# EAGLE board WestLaunch (EAGLE 7.7.0), part 1 of 2
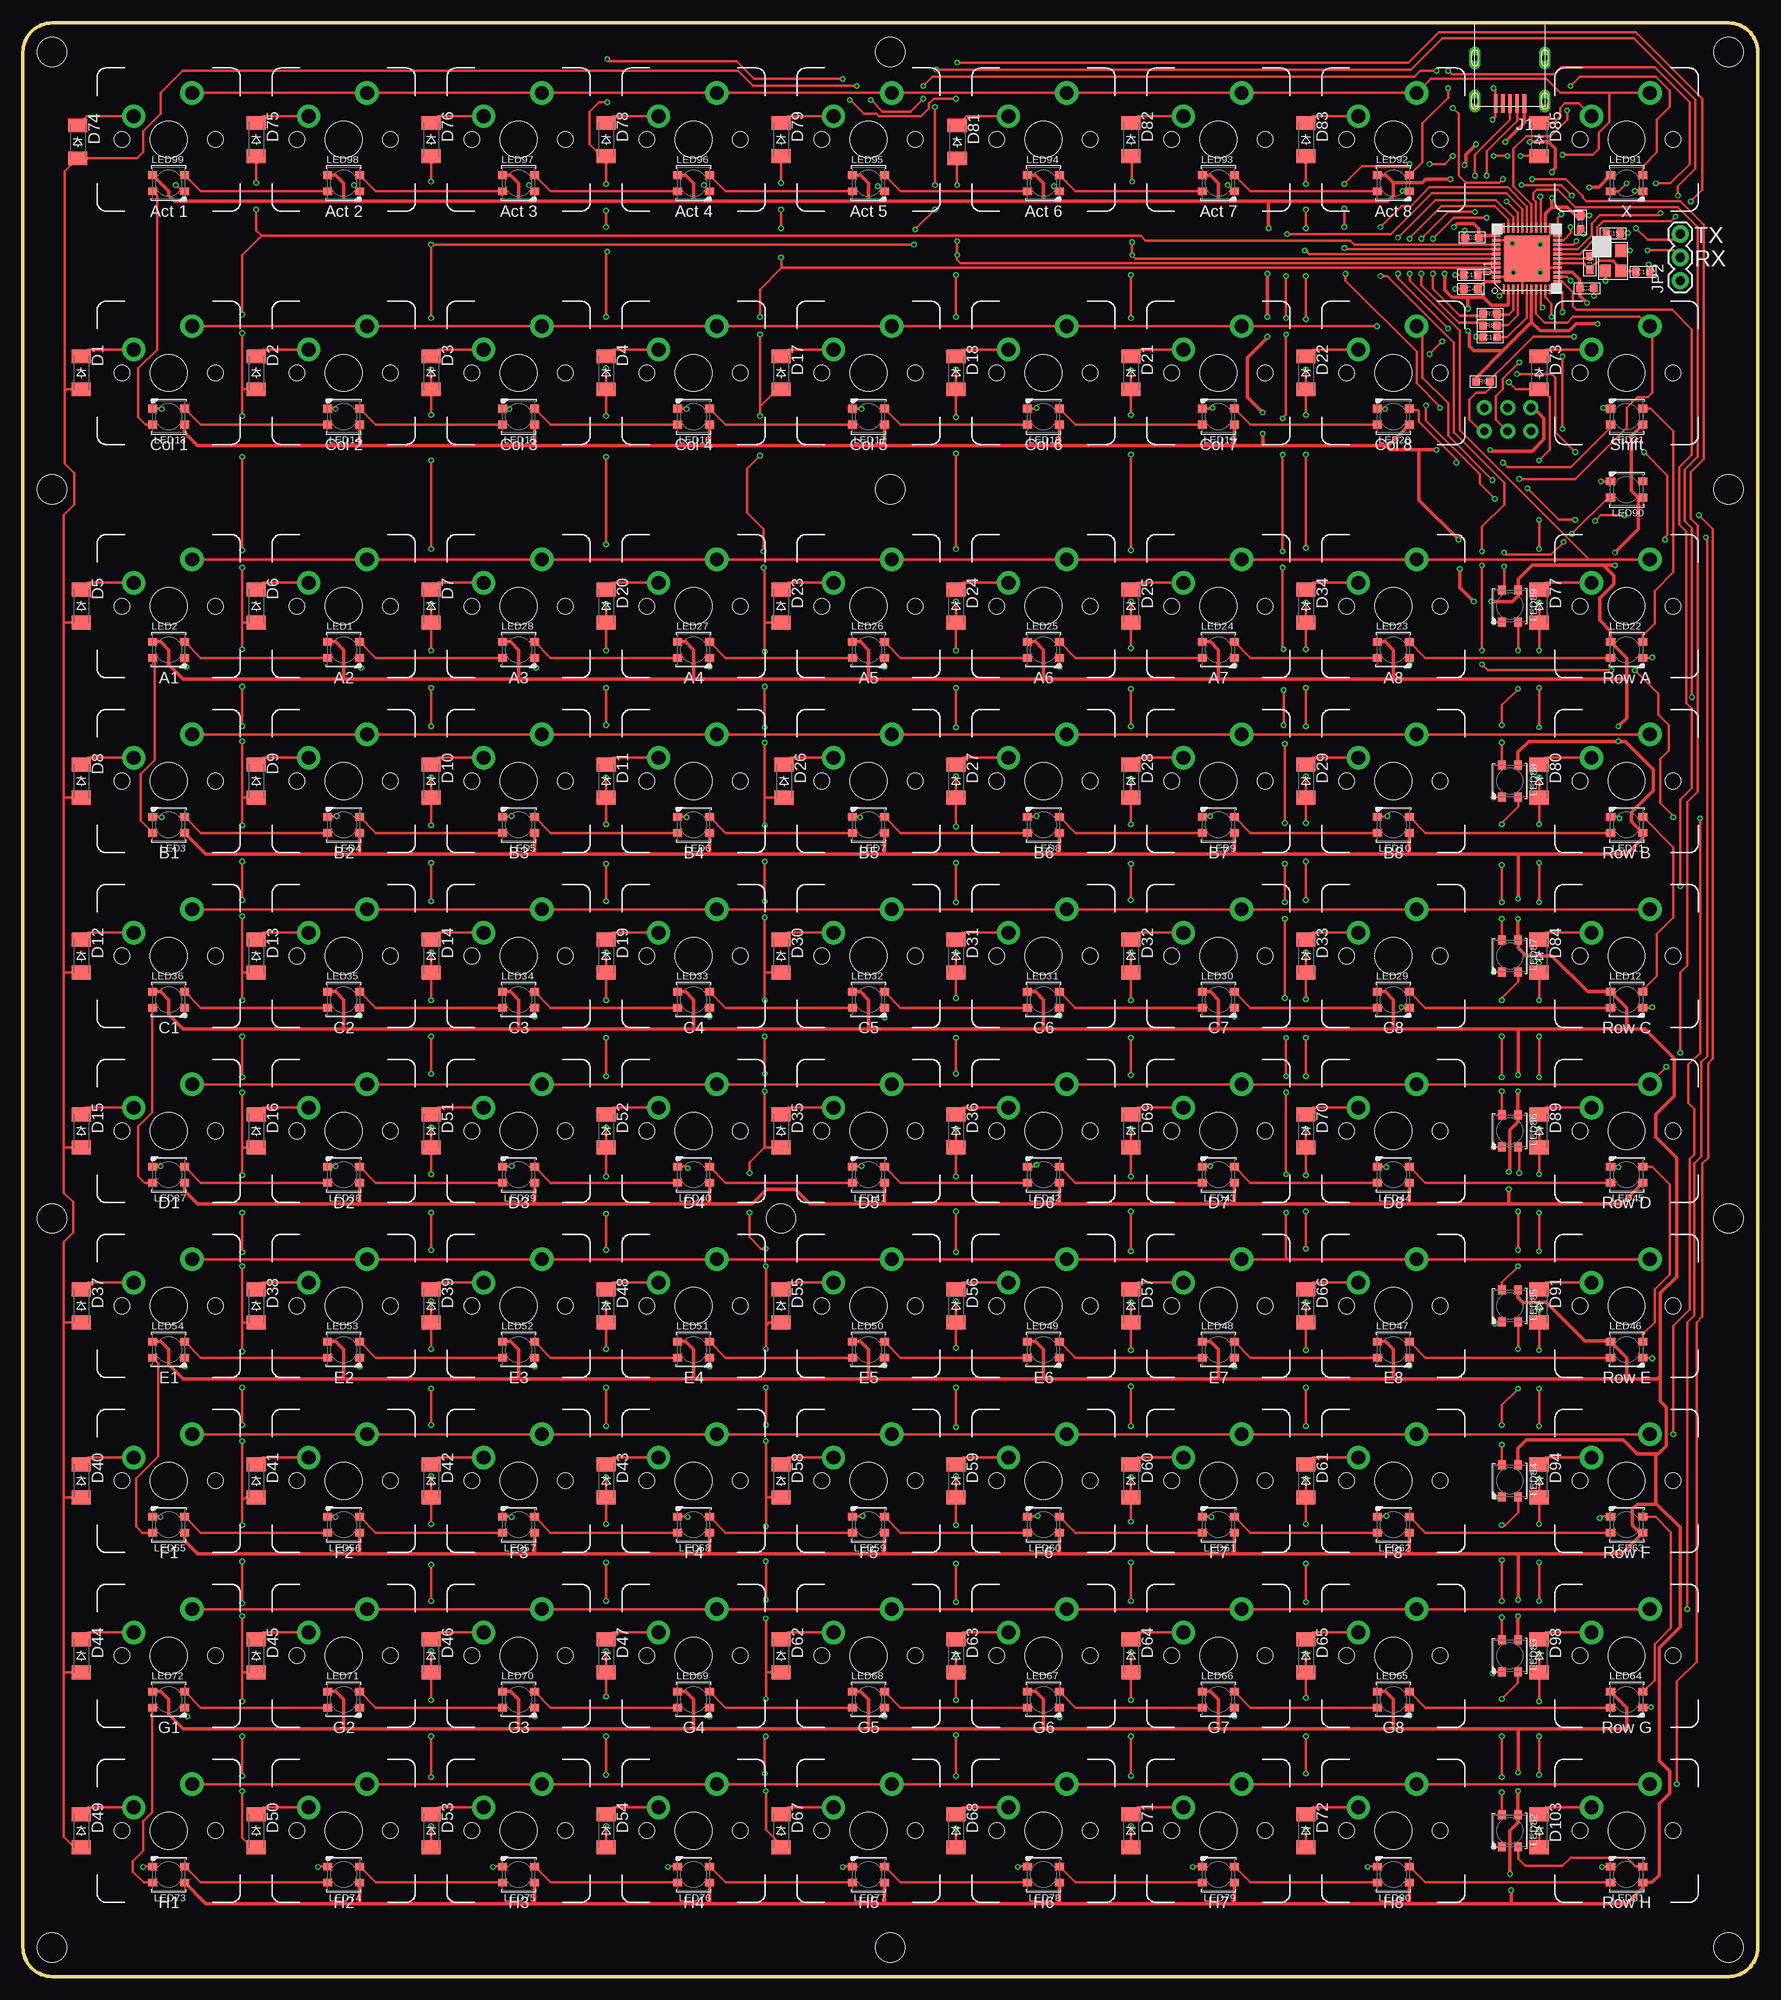
[diagram p2: board, top side]
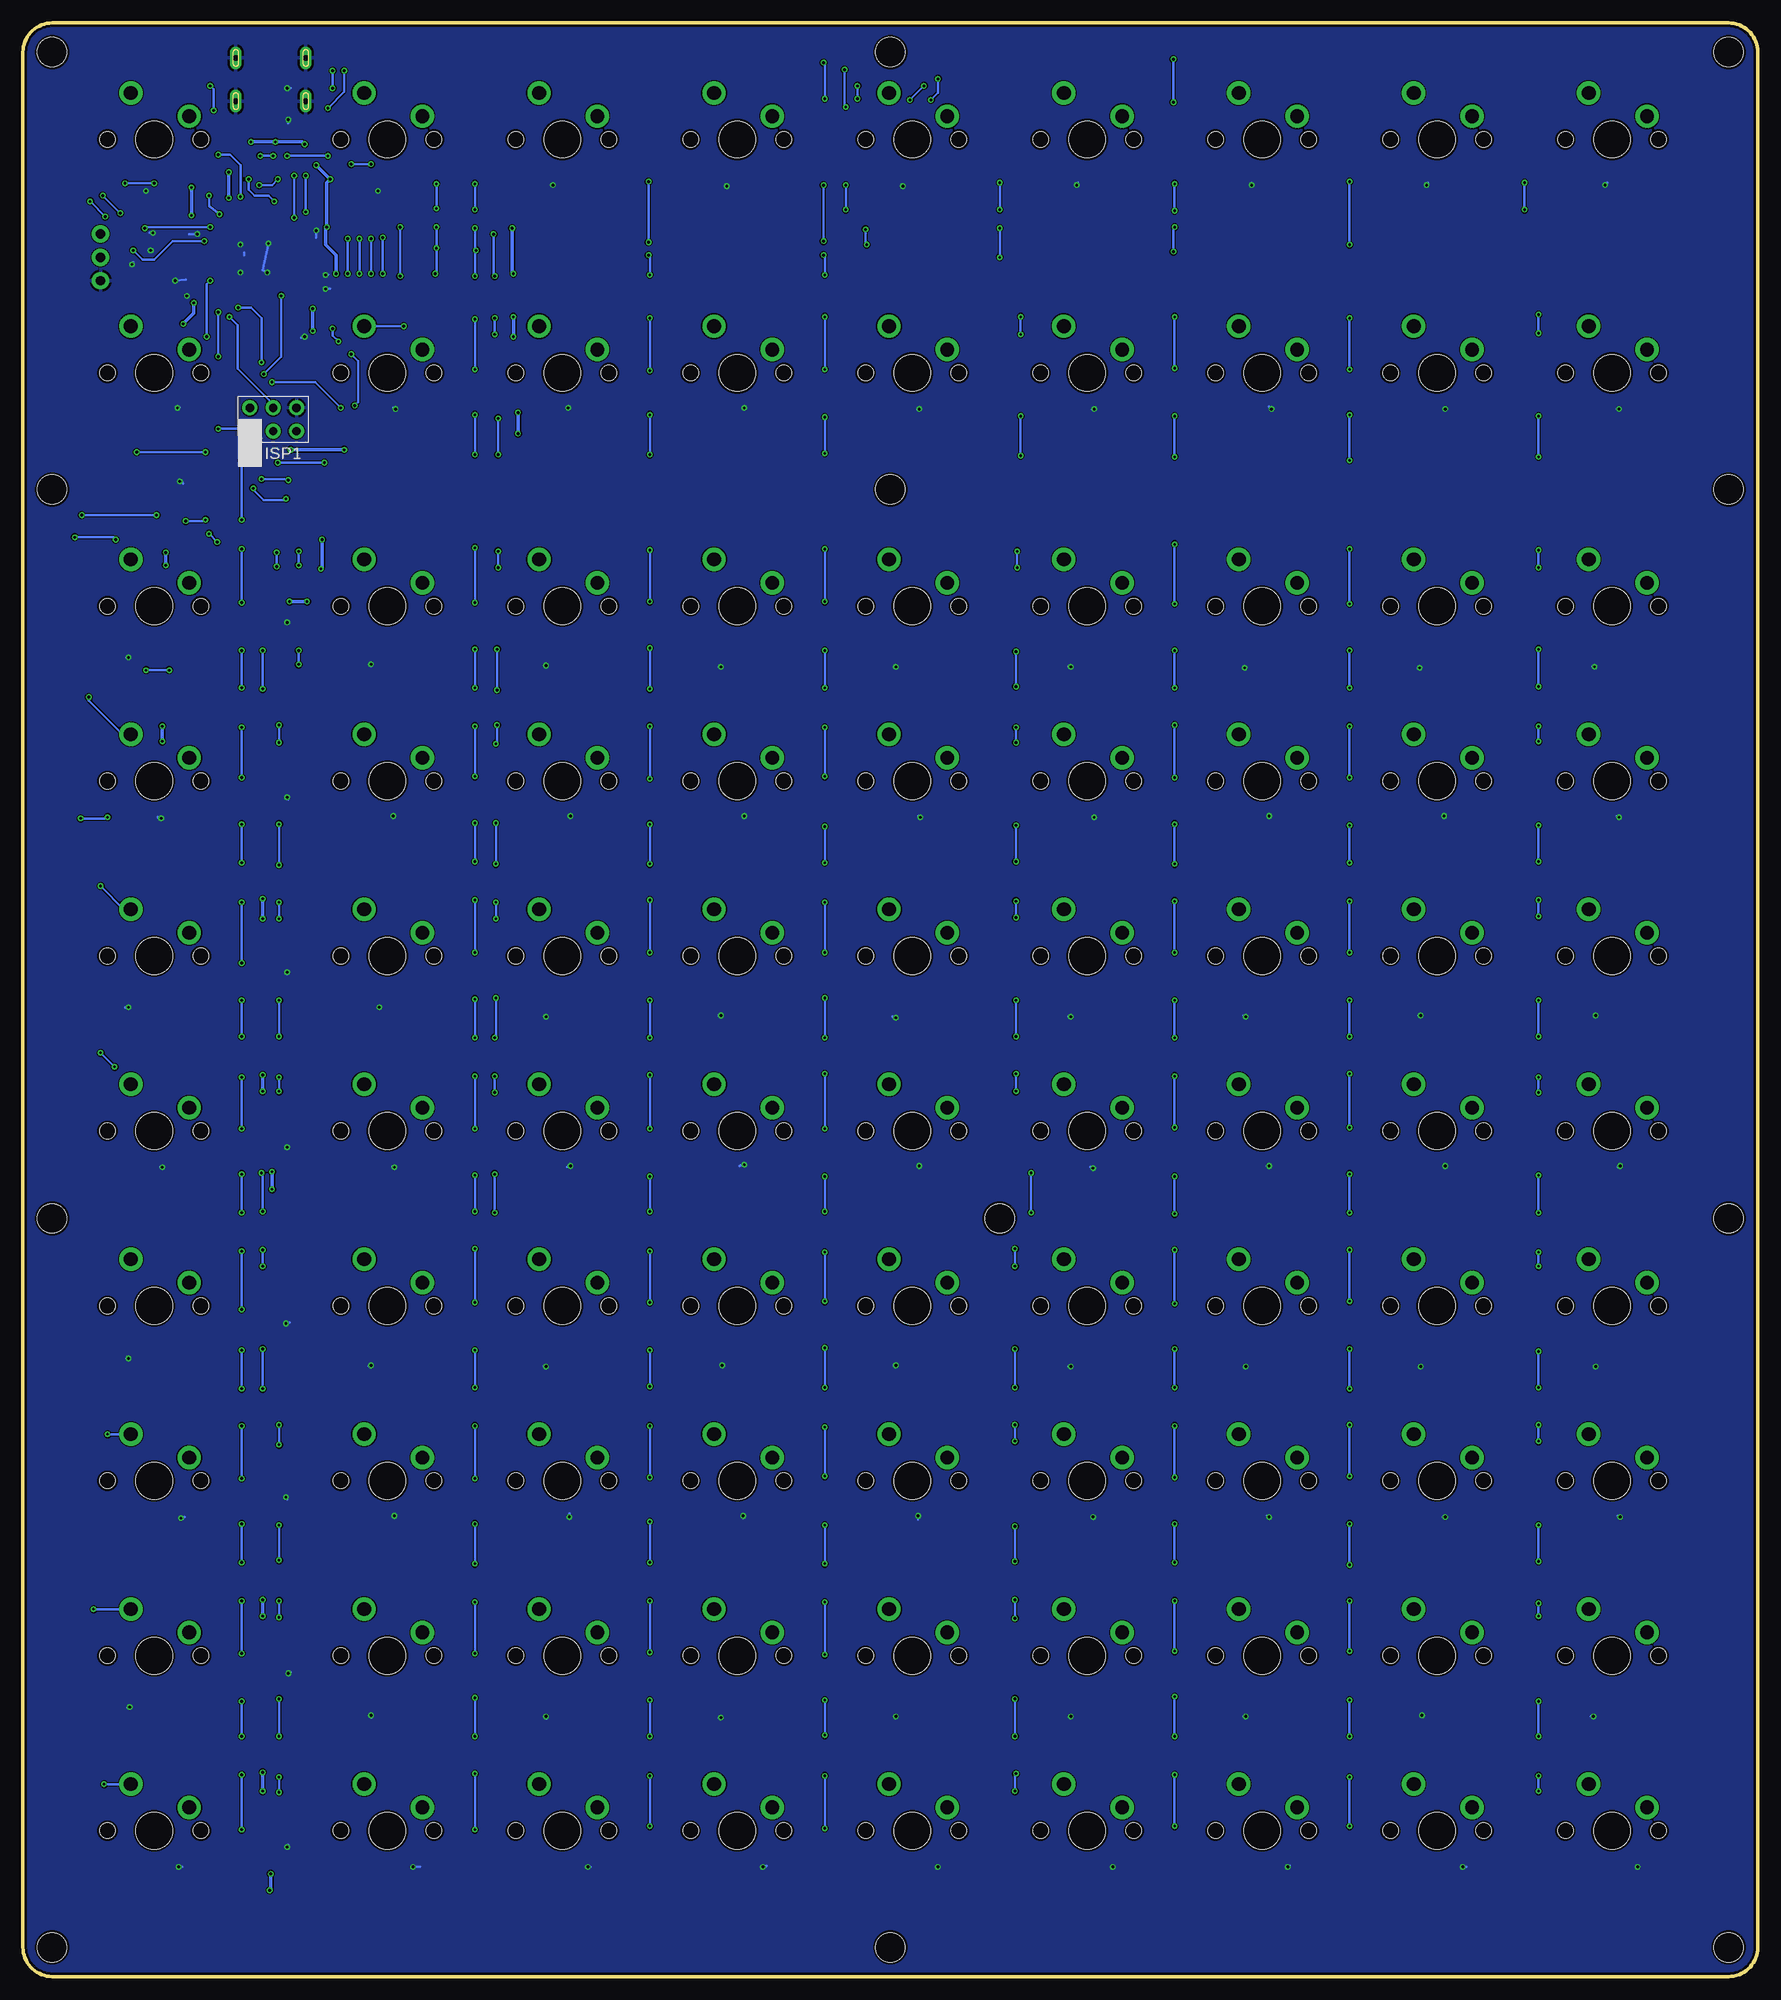
[diagram p3: board, bottom side, seen from below]

Size 188.91 x 212.72 mm. Coordinates in mm from the lower left corner, seen from the top.
Outline: 3.17,212.72 185.74,212.72 arc-90 188.91,209.55 188.91,3.18 arc-90 185.74,0 3.17,0 arc-90 0,3.18 0,209.55 arc-90 3.17,212.72
Copper layers (1*16): Top 0.035mm / dielectric 1.5mm / Bottom 0.035mm
Design rules "dirt_cheap_dirty_boards.v1": minimum track width 5mil, minimum drill 12mil, track to track 5mil, track to pad 5mil, pad to pad 5mil, via to via 5mil, smd to smd 0mil, copper to edge 10mil, drill to drill 10mil, minimum pad ring 10mil, minimum via ring 6mil, stop-mask expansion 2mil, vias tented up to drill 25mil, thermal gap 10mil
Net classes: 0 default: width 0.254 mm; 1 power: width 0.381 mm
Holes 3.2 mm at 3.17,209.55 3.17,3.18 3.17,161.93 94.46,161.93 185.74,209.55 185.74,3.18 185.74,82.55 82.55,82.55 94.46,3.18 94.46,209.55 3.17,82.55 185.74,161.93

## Footprints (pad centres in the part's own frame; a part is rotated, then mirrored left to right if it is on the bottom)
C0603 = smd 0.889 x 0.889: 1 -0.762,0; 2 0.762,0
SOD-123_MINI-SMA = smd 1.5 x 2.1: A 1.8,0; C -1.8,0
AVRISP = drill 0.9 pad 1.626: 1 -1.27,2.54; 2 1.27,2.54; 3 -1.27,0; 4 1.27,0; 5 -1.27,-2.54; 6 1.27,-2.54
MINI-B-5P-SMD = smd 0.406 x 2.032: 1 -1.575,4.191; 2 -0.787,4.191; 3 0,4.191; 4 0.787,4.191; 5 1.575,4.191 | drill 0.635 pad 1.27 long: GND@1 3.81,3.937; GND@2 3.81,-0.762; GND@3 -3.81,-0.762; GND@4 -3.81,3.937
1X03 = drill 1.016 pad 1.88: 1 0,0; 2 2.54,0; 3 5.08,0
LED3535 = smd 1 x 0.85: 1 -1.75,0.875; 2 -1.75,-0.875; 3 1.75,-0.875; 4 1.75,0.875
R0603 = smd 0.889 x 0.889: 1 -0.762,0; 2 0.762,0
MX1A-XXNW = drill 1.5 pad 2.54: 1 -3.81,2.54; 2 2.54,5.08 | hole 4: 0,0 | hole 1.7: -5.08,0; 5.08,0
QFN44 = smd 1 x 0.3: 1 -3.35,2.5; 2 -3.35,2; 3 -3.35,1.5; 4 -3.35,1; 5 -3.35,0.5; 6 -3.35,0; 7 -3.35,-0.5; 8 -3.35,-1; 9 -3.35,-1.5; 10 -3.35,-2; 11 -3.35,-2.5; 23 3.35,-2.5; 24 3.35,-2; 25 3.35,-1.5; 26 3.35,-1; 27 3.35,-0.5; 28 3.35,0; 29 3.35,0.5; 30 3.35,1; 31 3.35,1.5; 32 3.35,2; 33 3.35,2.5 | smd 0.3 x 1: 12 -2.5,-3.35; 13 -2,-3.35; 14 -1.5,-3.35; 15 -1,-3.35; 16 -0.5,-3.35; 17 0,-3.35; 18 0.5,-3.35; 19 1,-3.35; 20 1.5,-3.35; 21 2,-3.35; 22 2.5,-3.35; 34 2.5,3.35; 35 2,3.35; 36 1.5,3.35; 37 1,3.35; 38 0.5,3.35; 39 0,3.35; 40 -0.5,3.35; 41 -1,3.35; 42 -1.5,3.35; 43 -2,3.35; 44 -2.5,3.35 | smd 5.08 x 5.08: TAB 0,0
16MHZXTAL = smd 1.4 x 1.2: P$1 -1.1,-0.85; P$2 1.1,-0.85; P$3 1.1,0.85; P$4 -1.1,0.85

## Placement (x,y rotation side)
C1  100n  [C0603]  169.61,191.01 90 top
C2  100n  [C0603]  170.31,183.83 180 top
C3  100n  [C0603]  157.8,189.36 0 top
C4  100n  [C0603]  157.67,183.77 0 top
C13  100n  [C0603]  157.67,185.29 180 top
C14  1u  [C0603]  159.77,178.5 180 top
C15  22p  [C0603]  173.16,189.8 0 top
C16  22p  [C0603]  176.4,185.61 0 top
D1  CGRM4001-G  [SOD-123_MINI-SMA]  6.35,174.62 270 top
D2  CGRM4001-G  [SOD-123_MINI-SMA]  25.4,174.62 270 top
D3  CGRM4001-G  [SOD-123_MINI-SMA]  44.45,174.62 270 top
D4  CGRM4001-G  [SOD-123_MINI-SMA]  63.5,174.62 270 top
D5  CGRM4001-G  [SOD-123_MINI-SMA]  6.35,149.22 270 top
D6  CGRM4001-G  [SOD-123_MINI-SMA]  25.4,149.22 270 top
D7  CGRM4001-G  [SOD-123_MINI-SMA]  44.45,149.22 270 top
D8  CGRM4001-G  [SOD-123_MINI-SMA]  6.35,130.18 270 top
D9  CGRM4001-G  [SOD-123_MINI-SMA]  25.4,130.18 270 top
D10  CGRM4001-G  [SOD-123_MINI-SMA]  44.45,130.18 270 top
D11  CGRM4001-G  [SOD-123_MINI-SMA]  63.5,130.18 270 top
D12  CGRM4001-G  [SOD-123_MINI-SMA]  6.35,111.12 270 top
D13  CGRM4001-G  [SOD-123_MINI-SMA]  25.4,111.12 270 top
D14  CGRM4001-G  [SOD-123_MINI-SMA]  44.45,111.12 270 top
D15  CGRM4001-G  [SOD-123_MINI-SMA]  6.35,92.08 270 top
D16  CGRM4001-G  [SOD-123_MINI-SMA]  25.4,92.08 270 top
D17  CGRM4001-G  [SOD-123_MINI-SMA]  82.55,174.62 270 top
D18  CGRM4001-G  [SOD-123_MINI-SMA]  101.6,174.62 270 top
D19  CGRM4001-G  [SOD-123_MINI-SMA]  63.5,111.12 270 top
D20  CGRM4001-G  [SOD-123_MINI-SMA]  63.5,149.22 270 top
D21  CGRM4001-G  [SOD-123_MINI-SMA]  120.65,174.62 270 top
D22  CGRM4001-G  [SOD-123_MINI-SMA]  139.7,174.62 270 top
D23  CGRM4001-G  [SOD-123_MINI-SMA]  82.55,149.22 270 top
D24  CGRM4001-G  [SOD-123_MINI-SMA]  101.6,149.22 270 top
D25  CGRM4001-G  [SOD-123_MINI-SMA]  120.65,149.22 270 top
D26  CGRM4001-G  [SOD-123_MINI-SMA]  82.87,130.18 270 top
D27  CGRM4001-G  [SOD-123_MINI-SMA]  101.6,130.18 270 top
D28  CGRM4001-G  [SOD-123_MINI-SMA]  120.65,130.18 270 top
D29  CGRM4001-G  [SOD-123_MINI-SMA]  139.7,130.18 270 top
D30  CGRM4001-G  [SOD-123_MINI-SMA]  82.55,111.12 270 top
D31  CGRM4001-G  [SOD-123_MINI-SMA]  101.6,111.12 270 top
D32  CGRM4001-G  [SOD-123_MINI-SMA]  120.65,111.12 270 top
D33  CGRM4001-G  [SOD-123_MINI-SMA]  139.7,111.12 270 top
D34  CGRM4001-G  [SOD-123_MINI-SMA]  139.7,149.22 270 top
D35  CGRM4001-G  [SOD-123_MINI-SMA]  82.55,92.08 270 top
D36  CGRM4001-G  [SOD-123_MINI-SMA]  101.6,92.08 270 top
D37  CGRM4001-G  [SOD-123_MINI-SMA]  6.35,73.03 270 top
D38  CGRM4001-G  [SOD-123_MINI-SMA]  25.4,73.03 270 top
D39  CGRM4001-G  [SOD-123_MINI-SMA]  44.45,73.03 270 top
D40  CGRM4001-G  [SOD-123_MINI-SMA]  6.35,53.97 270 top
D41  CGRM4001-G  [SOD-123_MINI-SMA]  25.4,53.97 270 top
D42  CGRM4001-G  [SOD-123_MINI-SMA]  44.45,53.97 270 top
D43  CGRM4001-G  [SOD-123_MINI-SMA]  63.5,53.97 270 top
D44  CGRM4001-G  [SOD-123_MINI-SMA]  6.35,34.92 270 top
D45  CGRM4001-G  [SOD-123_MINI-SMA]  25.4,34.92 270 top
D46  CGRM4001-G  [SOD-123_MINI-SMA]  44.45,34.92 270 top
D47  CGRM4001-G  [SOD-123_MINI-SMA]  63.5,34.92 270 top
D48  CGRM4001-G  [SOD-123_MINI-SMA]  63.5,73.03 270 top
D49  CGRM4001-G  [SOD-123_MINI-SMA]  6.35,15.88 270 top
D50  CGRM4001-G  [SOD-123_MINI-SMA]  25.4,15.88 270 top
D51  CGRM4001-G  [SOD-123_MINI-SMA]  44.45,92.08 270 top
D52  CGRM4001-G  [SOD-123_MINI-SMA]  63.5,92.08 270 top
D53  CGRM4001-G  [SOD-123_MINI-SMA]  44.45,15.88 270 top
D54  CGRM4001-G  [SOD-123_MINI-SMA]  63.5,15.88 270 top
D55  CGRM4001-G  [SOD-123_MINI-SMA]  82.55,73.03 270 top
D56  CGRM4001-G  [SOD-123_MINI-SMA]  101.6,73.03 270 top
D57  CGRM4001-G  [SOD-123_MINI-SMA]  120.65,73.03 270 top
D58  CGRM4001-G  [SOD-123_MINI-SMA]  82.55,53.97 270 top
D59  CGRM4001-G  [SOD-123_MINI-SMA]  101.6,53.97 270 top
D60  CGRM4001-G  [SOD-123_MINI-SMA]  120.65,53.97 270 top
D61  CGRM4001-G  [SOD-123_MINI-SMA]  139.7,53.97 270 top
D62  CGRM4001-G  [SOD-123_MINI-SMA]  82.55,34.92 270 top
D63  CGRM4001-G  [SOD-123_MINI-SMA]  101.6,34.92 270 top
D64  CGRM4001-G  [SOD-123_MINI-SMA]  120.65,34.92 270 top
D65  CGRM4001-G  [SOD-123_MINI-SMA]  139.7,34.92 270 top
D66  CGRM4001-G  [SOD-123_MINI-SMA]  139.7,73.03 270 top
D67  CGRM4001-G  [SOD-123_MINI-SMA]  82.55,15.88 270 top
D68  CGRM4001-G  [SOD-123_MINI-SMA]  101.6,15.88 270 top
D69  CGRM4001-G  [SOD-123_MINI-SMA]  120.65,92.08 270 top
D70  CGRM4001-G  [SOD-123_MINI-SMA]  139.7,92.08 270 top
D71  CGRM4001-G  [SOD-123_MINI-SMA]  120.65,15.88 270 top
D72  CGRM4001-G  [SOD-123_MINI-SMA]  139.7,15.88 270 top
D73  CGRM4001-G  [SOD-123_MINI-SMA]  165.1,174.62 270 top
D74  CGRM4001-G  [SOD-123_MINI-SMA]  5.97,199.77 270 top
D75  CGRM4001-G  [SOD-123_MINI-SMA]  25.4,200.03 270 top
D76  CGRM4001-G  [SOD-123_MINI-SMA]  44.45,200.03 270 top
D77  CGRM4001-G  [SOD-123_MINI-SMA]  165.1,149.22 270 top
D78  CGRM4001-G  [SOD-123_MINI-SMA]  63.5,200.03 270 top
D79  CGRM4001-G  [SOD-123_MINI-SMA]  82.55,200.03 270 top
D80  CGRM4001-G  [SOD-123_MINI-SMA]  165.1,130.18 270 top
D81  CGRM4001-G  [SOD-123_MINI-SMA]  101.73,199.77 270 top
D82  CGRM4001-G  [SOD-123_MINI-SMA]  120.65,200.03 270 top
D83  CGRM4001-G  [SOD-123_MINI-SMA]  139.7,200.03 270 top
D84  CGRM4001-G  [SOD-123_MINI-SMA]  165.1,111.12 270 top
D85  CGRM4001-G  [SOD-123_MINI-SMA]  165.1,200.03 270 top
D89  CGRM4001-G  [SOD-123_MINI-SMA]  165.1,92.08 270 top
D91  CGRM4001-G  [SOD-123_MINI-SMA]  165.1,73.03 270 top
D94  CGRM4001-G  [SOD-123_MINI-SMA]  165.1,53.97 270 top
D98  CGRM4001-G  [SOD-123_MINI-SMA]  165.1,34.92 270 top
D103  CGRM4001-G  [SOD-123_MINI-SMA]  165.1,15.88 270 top
ISP1  AVRISP-6  [AVRISP]  161.67,169.54 90 bottom
J1  MINI-USB-5P-3400030P1  [MINI-B-5P-SMD]  161.92,208.15 180 top
JP2  [1X03]  180.47,184.66 90 top
LED1  WS2812B3535  [LED3535]  34.93,144.46 0 top
LED2  WS2812B3535  [LED3535]  15.87,144.46 0 top
LED3  WS2812B3535  [LED3535]  15.87,125.41 180 top
LED4  WS2812B3535  [LED3535]  34.93,125.41 180 top
LED5  WS2812B3535  [LED3535]  53.98,125.41 180 top
LED6  WS2812B3535  [LED3535]  73.02,125.41 180 top
LED7  WS2812B3535  [LED3535]  92.07,125.41 180 top
LED8  WS2812B3535  [LED3535]  111.12,125.41 180 top
LED9  WS2812B3535  [LED3535]  130.17,125.41 180 top
LED10  WS2812B3535  [LED3535]  149.22,125.41 180 top
LED11  WS2812B3535  [LED3535]  174.62,125.41 180 top
LED12  WS2812B3535  [LED3535]  174.62,106.36 0 top
LED13  WS2812B3535  [LED3535]  15.87,169.86 180 top
LED14  WS2812B3535  [LED3535]  34.93,169.86 180 top
LED15  WS2812B3535  [LED3535]  53.98,169.86 180 top
LED16  WS2812B3535  [LED3535]  73.02,169.86 180 top
LED17  WS2812B3535  [LED3535]  92.07,169.86 180 top
LED18  WS2812B3535  [LED3535]  111.12,169.86 180 top
LED19  WS2812B3535  [LED3535]  130.17,169.86 180 top
LED20  WS2812B3535  [LED3535]  149.22,169.86 180 top
LED21  WS2812B3535  [LED3535]  174.62,169.86 180 top
LED22  WS2812B3535  [LED3535]  174.62,144.46 0 top
LED23  WS2812B3535  [LED3535]  149.22,144.46 0 top
LED24  WS2812B3535  [LED3535]  130.17,144.46 0 top
LED25  WS2812B3535  [LED3535]  111.12,144.46 0 top
LED26  WS2812B3535  [LED3535]  92.07,144.46 0 top
LED27  WS2812B3535  [LED3535]  73.02,144.46 0 top
LED28  WS2812B3535  [LED3535]  53.98,144.46 0 top
LED29  WS2812B3535  [LED3535]  149.22,106.36 0 top
LED30  WS2812B3535  [LED3535]  130.17,106.36 0 top
LED31  WS2812B3535  [LED3535]  111.12,106.36 0 top
LED32  WS2812B3535  [LED3535]  92.07,106.36 0 top
LED33  WS2812B3535  [LED3535]  73.02,106.36 0 top
LED34  WS2812B3535  [LED3535]  53.98,106.36 0 top
LED35  WS2812B3535  [LED3535]  34.93,106.36 0 top
LED36  WS2812B3535  [LED3535]  15.87,106.36 0 top
LED37  WS2812B3535  [LED3535]  15.87,87.31 180 top
LED38  WS2812B3535  [LED3535]  34.93,87.31 180 top
LED39  WS2812B3535  [LED3535]  53.98,87.31 180 top
LED40  WS2812B3535  [LED3535]  73.02,87.31 180 top
LED41  WS2812B3535  [LED3535]  92.07,87.31 180 top
LED42  WS2812B3535  [LED3535]  111.12,87.31 180 top
LED43  WS2812B3535  [LED3535]  130.17,87.31 180 top
LED44  WS2812B3535  [LED3535]  149.22,87.31 180 top
LED45  WS2812B3535  [LED3535]  174.62,87.31 180 top
LED46  WS2812B3535  [LED3535]  174.62,68.26 0 top
LED47  WS2812B3535  [LED3535]  149.22,68.26 0 top
LED48  WS2812B3535  [LED3535]  130.17,68.26 0 top
LED49  WS2812B3535  [LED3535]  111.12,68.26 0 top
LED50  WS2812B3535  [LED3535]  92.07,68.26 0 top
LED51  WS2812B3535  [LED3535]  73.02,68.26 0 top
LED52  WS2812B3535  [LED3535]  53.98,68.26 0 top
LED53  WS2812B3535  [LED3535]  34.93,68.26 0 top
LED54  WS2812B3535  [LED3535]  15.87,68.26 0 top
LED55  WS2812B3535  [LED3535]  15.87,49.21 180 top
LED56  WS2812B3535  [LED3535]  34.93,49.21 180 top
LED57  WS2812B3535  [LED3535]  53.98,49.21 180 top
LED58  WS2812B3535  [LED3535]  73.02,49.21 180 top
LED59  WS2812B3535  [LED3535]  92.07,49.21 180 top
LED60  WS2812B3535  [LED3535]  111.12,49.21 180 top
LED61  WS2812B3535  [LED3535]  130.17,49.21 180 top
LED62  WS2812B3535  [LED3535]  149.22,49.21 180 top
LED63  WS2812B3535  [LED3535]  174.62,49.21 180 top
LED64  WS2812B3535  [LED3535]  174.62,30.16 0 top
LED65  WS2812B3535  [LED3535]  149.22,30.16 0 top
LED66  WS2812B3535  [LED3535]  130.17,30.16 0 top
LED67  WS2812B3535  [LED3535]  111.12,30.16 0 top
LED68  WS2812B3535  [LED3535]  92.07,30.16 0 top
LED69  WS2812B3535  [LED3535]  73.02,30.16 0 top
LED70  WS2812B3535  [LED3535]  53.98,30.16 0 top
LED71  WS2812B3535  [LED3535]  34.93,30.16 0 top
LED72  WS2812B3535  [LED3535]  15.87,30.16 0 top
LED73  WS2812B3535  [LED3535]  15.87,11.11 180 top
LED74  WS2812B3535  [LED3535]  34.93,11.11 180 top
LED75  WS2812B3535  [LED3535]  53.98,11.11 180 top
LED76  WS2812B3535  [LED3535]  73.02,11.11 180 top
LED77  WS2812B3535  [LED3535]  92.07,11.11 180 top
LED78  WS2812B3535  [LED3535]  111.12,11.11 180 top
LED79  WS2812B3535  [LED3535]  130.17,11.11 180 top
LED80  WS2812B3535  [LED3535]  149.22,11.11 180 top
LED81  WS2812B3535  [LED3535]  174.62,11.11 180 top
LED82  WS2812B3535  [LED3535]  161.92,15.88 270 top
LED83  WS2812B3535  [LED3535]  161.92,34.92 270 top
LED84  WS2812B3535  [LED3535]  161.92,53.97 270 top
LED85  WS2812B3535  [LED3535]  161.92,73.03 270 top
LED86  WS2812B3535  [LED3535]  161.92,92.08 270 top
LED87  WS2812B3535  [LED3535]  161.92,111.12 270 top
LED88  WS2812B3535  [LED3535]  161.92,130.18 270 top
LED89  WS2812B3535  [LED3535]  161.92,149.22 270 top
LED90  WS2812B3535  [LED3535]  174.62,161.93 180 top
LED91  WS2812B3535  [LED3535]  174.62,195.26 0 top
LED92  WS2812B3535  [LED3535]  149.22,195.26 0 top
LED93  WS2812B3535  [LED3535]  130.17,195.26 0 top
LED94  WS2812B3535  [LED3535]  111.12,195.26 0 top
LED95  WS2812B3535  [LED3535]  92.07,195.26 0 top
LED96  WS2812B3535  [LED3535]  73.02,195.26 0 top
LED97  WS2812B3535  [LED3535]  53.98,195.26 0 top
LED98  WS2812B3535  [LED3535]  34.93,195.26 0 top
LED99  WS2812B3535  [LED3535]  15.87,195.26 0 top
R7  22  [R0603]  159.77,181.04 180 top
R8  22  [R0603]  159.77,179.77 180 top
R9  10k  [R0603]  159,173.67 180 top
R10  1M  [R0603]  170.62,186.56 270 top
SW1  D1  [MX1A-XXNW]  15.87,92.08 0 top
SW2  D2  [MX1A-XXNW]  34.93,92.08 0 top
SW3  Col 5  [MX1A-XXNW]  92.07,174.62 0 top
SW4  Col 6  [MX1A-XXNW]  111.12,174.62 0 top
SW5  Col 7  [MX1A-XXNW]  130.17,174.62 0 top
SW6  Col 8  [MX1A-XXNW]  149.22,174.62 0 top
SW7  A5  [MX1A-XXNW]  92.07,149.22 0 top
SW8  A6  [MX1A-XXNW]  111.12,149.22 0 top
SW9  A7  [MX1A-XXNW]  130.17,149.22 0 top
SW10  A8  [MX1A-XXNW]  149.22,149.22 0 top
SW11  B5  [MX1A-XXNW]  92.07,130.18 0 top
SW12  B6  [MX1A-XXNW]  111.12,130.18 0 top
SW13  C5  [MX1A-XXNW]  92.07,111.12 0 top
SW14  C6  [MX1A-XXNW]  111.12,111.12 0 top
SW15  C8  [MX1A-XXNW]  149.22,111.12 0 top
SW16  C7  [MX1A-XXNW]  130.17,111.12 0 top
SW17  B8  [MX1A-XXNW]  149.22,130.18 0 top
SW18  B7  [MX1A-XXNW]  130.17,130.18 0 top
SW19  D5  [MX1A-XXNW]  92.07,92.08 0 top
SW20  D6  [MX1A-XXNW]  111.12,92.08 0 top
SW21  D3  [MX1A-XXNW]  53.98,92.08 0 top
SW22  D4  [MX1A-XXNW]  73.02,92.08 0 top
SW23  E1  [MX1A-XXNW]  15.87,73.03 0 top
SW24  E2  [MX1A-XXNW]  34.93,73.03 0 top
SW25  E3  [MX1A-XXNW]  53.98,73.03 0 top
SW26  E4  [MX1A-XXNW]  73.02,73.03 0 top
SW27  F1  [MX1A-XXNW]  15.87,53.97 0 top
SW28  F2  [MX1A-XXNW]  34.93,53.97 0 top
SW29  G1  [MX1A-XXNW]  15.87,34.92 0 top
SW30  G2  [MX1A-XXNW]  34.93,34.92 0 top
SW31  G4  [MX1A-XXNW]  73.02,34.92 0 top
SW32  G3  [MX1A-XXNW]  53.98,34.92 0 top
SW33  F4  [MX1A-XXNW]  73.02,53.97 0 top
SW34  F3  [MX1A-XXNW]  53.98,53.97 0 top
SW35  H1  [MX1A-XXNW]  15.87,15.88 0 top
SW36  H2  [MX1A-XXNW]  34.93,15.88 0 top
SW37  H3  [MX1A-XXNW]  53.98,15.88 0 top
SW38  H4  [MX1A-XXNW]  73.02,15.88 0 top
SW39  D7  [MX1A-XXNW]  130.17,92.08 0 top
SW40  D8  [MX1A-XXNW]  149.22,92.08 0 top
SW41  E5  [MX1A-XXNW]  92.07,73.03 0 top
SW42  E6  [MX1A-XXNW]  111.12,73.03 0 top
SW43  E7  [MX1A-XXNW]  130.17,73.03 0 top
SW44  E8  [MX1A-XXNW]  149.22,73.03 0 top
SW45  F5  [MX1A-XXNW]  92.07,53.97 0 top
SW46  Col 1  [MX1A-XXNW]  15.87,174.62 0 top
SW47  Col 2  [MX1A-XXNW]  34.93,174.62 0 top
SW48  Col 3  [MX1A-XXNW]  53.98,174.62 0 top
SW49  Col 4  [MX1A-XXNW]  73.02,174.62 0 top
SW50  F6  [MX1A-XXNW]  111.12,53.97 0 top
SW51  A1  [MX1A-XXNW]  15.87,149.22 0 top
SW52  A2  [MX1A-XXNW]  34.93,149.22 0 top
SW53  A3  [MX1A-XXNW]  53.98,149.22 0 top
SW54  A4  [MX1A-XXNW]  73.02,149.22 0 top
SW55  B1  [MX1A-XXNW]  15.87,130.18 0 top
SW56  B2  [MX1A-XXNW]  34.93,130.18 0 top
SW57  G5  [MX1A-XXNW]  92.07,34.92 0 top
SW58  C1  [MX1A-XXNW]  15.87,111.12 0 top
SW59  C2  [MX1A-XXNW]  34.93,111.12 0 top
SW60  C4  [MX1A-XXNW]  73.02,111.12 0 top
SW61  G6  [MX1A-XXNW]  111.12,34.92 0 top
SW62  G8  [MX1A-XXNW]  149.22,34.92 0 top
SW63  G7  [MX1A-XXNW]  130.17,34.92 0 top
SW64  F8  [MX1A-XXNW]  149.22,53.97 0 top
SW65  F7  [MX1A-XXNW]  130.17,53.97 0 top
SW66  H5  [MX1A-XXNW]  92.07,15.88 0 top
SW67  H6  [MX1A-XXNW]  111.12,15.88 0 top
SW68  H7  [MX1A-XXNW]  130.17,15.88 0 top
SW69  H8  [MX1A-XXNW]  149.22,15.88 0 top
SW70  Shift  [MX1A-XXNW]  174.62,174.62 0 top
SW71  Act 1  [MX1A-XXNW]  15.87,200.03 0 top
SW72  Act 2  [MX1A-XXNW]  34.93,200.03 0 top
SW73  Act 3  [MX1A-XXNW]  53.98,200.03 0 top
SW74  Row A  [MX1A-XXNW]  174.62,149.22 0 top
SW75  Act 4  [MX1A-XXNW]  73.02,200.03 0 top
SW76  Act 5  [MX1A-XXNW]  92.07,200.03 0 top
SW77  Act 6  [MX1A-XXNW]  111.12,200.03 0 top
SW78  Row B  [MX1A-XXNW]  174.62,130.18 0 top
SW79  Act 7  [MX1A-XXNW]  130.17,200.03 0 top
SW80  Row C  [MX1A-XXNW]  174.62,111.12 0 top
SW81  Act 8  [MX1A-XXNW]  149.22,200.03 0 top
SW82  X  [MX1A-XXNW]  174.62,200.03 0 top
SW83  C3  [MX1A-XXNW]  53.98,111.12 0 top
SW87  Row D  [MX1A-XXNW]  174.62,92.08 0 top
SW88  B4  [MX1A-XXNW]  73.02,130.18 0 top
SW90  B3  [MX1A-XXNW]  53.98,130.18 0 top
SW93  Row E  [MX1A-XXNW]  174.62,73.03 0 top
SW97  Row F  [MX1A-XXNW]  174.62,53.97 0 top
SW99  Row G  [MX1A-XXNW]  174.62,34.92 0 top
SW105  Row H  [MX1A-XXNW]  174.62,15.88 0 top
U1  ATMEGA32U4-MU  [QFN44]  163.77,187.07 90 top
U$60  RESONATOR  [16MHZXTAL]  173.16,186.82 270 top

## Tracks (layer width: path | path; a pad name or v marks a point on that pad's centre or on a via)
5V  (via drill 0.3)
  Top 0.381: 166.5,192.66 168.15,192.66 169.29,191.52 C1.2 v170.56,191.77 | U1.24 165.77,191.93 166.5,192.66 | U1.14 168.69,185.57 168.78,185.55 169.54,184.78 C2.2 169.54,183.01 v170.31,182.25 | U1.34 158.77,189.57 C3.2 158.56,190.31 157.99,190.88 156.21,190.88 v155.83,190.5 | U1.44 159.23,184.57 C4.2 159,183.2 159,182.88 | v170.56,194.82 171.58,194.82 LED91.1 | J1.1 163.5,201.85 v161.42,199.77 | v164.08,199.77 166.12,199.77 166.88,199.01 166.88,196.98 166.5,196.6 v166.5,196.47 | v166.5,193.68 166.5,192.66 | LED92.1 148.41,196.14 149.22,195.33 | 149.22,195.33 149.22,193.93 148.59,193.29 135.64,193.29 | 135.64,193.29 130.17,193.29 | 130.17,193.29 111.12,193.29 | 111.12,193.29 92.07,193.29 | 92.07,193.29 73.02,193.29 | 73.02,193.29 53.98,193.29 | 53.98,193.29 34.93,193.29 | 34.93,193.29 16.51,193.29 15.87,193.93 15.87,194.39 LED99.1 | U1.7 164.27,180.14 | R9.2 158.24,174.12 161.16,177.04 | 161.16,177.04 164.27,180.14 | 150.81,7.94 131.76,7.94 | 131.76,7.94 112.71,7.94 | 112.71,7.94 93.66,7.94 | 93.66,7.94 74.61,7.94 | 74.61,7.94 55.56,7.94 | 55.56,7.94 36.51,7.94 | 36.51,7.94 19.92,7.94 LED73.1 | LED55.1 17.62,47.46 19.05,46.04 36.51,46.04 | 36.51,46.04 55.75,46.04 | 55.75,46.04 74.61,46.04 | 74.61,46.04 93.66,46.04 | 93.66,46.04 112.71,46.04 | 112.71,46.04 131.76,46.04 | 131.76,46.04 150.81,46.04 | 150.81,46.04 162.69,46.04 | 162.69,46.04 174.07,46.04 LED63.1 176.07,48.34 175.26,49.15 175.26,50.93 175.77,51.44 177.8,51.44 | LED62.1 150.97,46.2 150.81,46.04 | LED61.1 131.92,46.2 131.76,46.04 | LED60.1 112.88,46.2 112.71,46.04 | LED59.1 93.82,46.2 93.66,46.04 | LED58.1 74.77,46.2 74.61,46.04 | LED56.1 36.68,46.2 36.51,46.04
  Top 0.381: LED72.1 15,31.04 15.87,30.16 15.87,28.57 17.46,26.99 34.93,26.99 | 34.93,26.99 53.98,26.99 | 53.98,26.99 73.02,26.99 | 73.02,26.99 92.07,26.99 | 92.07,26.99 111.12,26.99 | 111.12,26.99 130.17,26.99 | 130.17,26.99 149.22,26.99 | 149.22,26.99 162.69,26.99 | 162.69,26.99 174.62,26.99 174.62,29.29 LED64.1 | LED65.1 148.35,31.04 149.22,30.16 149.22,26.99 | LED66.1 129.3,31.04 130.17,30.16 130.17,26.99 | LED67.1 110.25,31.04 111.12,30.16 111.12,26.99 | LED68.1 91.2,31.04 92.07,30.16 92.07,26.99 | LED69.1 72.15,31.04 73.02,30.16 73.02,26.99 | LED70.1 53.1,31.04 53.98,30.16 53.98,26.99 | LED71.1 34.05,31.04 34.93,30.16 34.93,26.99 | LED74.1 36.68,8.1 36.51,7.94 | LED75.1 55.73,8.1 55.56,7.94 | LED76.1 74.77,8.1 74.61,7.94 | LED77.1 93.82,8.1 93.66,7.94 | LED78.1 112.88,8.1 112.71,7.94 | LED80.1 150.97,8.1 150.81,7.94 | LED79.1 131.92,8.1 131.76,7.94 | LED2.1 15,145.34 15.87,144.46 15.87,142.88 17.46,141.29 34.93,141.29 | 34.93,141.29 53.98,141.29 | 53.98,141.29 73.02,141.29 | 73.02,141.29 92.07,141.29 | 92.07,141.29 111.12,141.29 | 111.12,141.29 130.17,141.29 | 130.17,141.29 149.22,141.29 | 149.22,141.29 174.62,141.29 | 174.62,141.29 174.62,143.59 LED22.1 172.88,146.53 171.7,147.7 171.7,150.11 173.23,151.64 173.23,152.53 172.09,153.67 | LED23.1 148.35,145.34 149.22,144.46 149.22,141.29 | LED24.1 129.3,145.34 130.17,144.46 130.17,141.29 | LED25.1 110.25,145.34 111.12,144.46 111.12,141.29 | LED26.1 91.2,145.34 92.07,144.46 92.07,141.29 | LED27.1 72.15,145.34 73.02,144.46 73.02,141.29 | LED28.1 53.1,145.34 53.98,144.46 53.98,141.29 | LED1.1 34.05,145.34 34.93,144.46 34.93,141.29 | LED13.1 17.62,168.11 19.05,166.69 36.51,166.69
  Top 0.381: 36.51,166.69 55.56,166.69 | 55.56,166.69 74.61,166.69 | 74.61,166.69 93.66,166.69 | 93.66,166.69 112.71,166.69 | 112.71,166.69 131.76,166.69 | 131.76,166.69 135,166.69 | 135,166.69 148.46,166.69 | 148.46,166.69 148.67,166.69 LED20.1 | LED19.1 131.92,166.85 131.76,166.69 | LED18.1 112.88,166.85 112.71,166.69 | LED17.1 93.82,166.85 93.66,166.69 | LED16.1 74.77,166.85 74.61,166.69 | LED15.1 55.73,166.85 55.56,166.69 | LED14.1 36.68,166.85 36.51,166.69 | LED98.1 34.05,196.14 34.93,195.26 34.93,193.29 | LED97.1 53.1,196.14 53.98,195.26 53.98,193.29 | LED96.1 72.15,196.14 73.02,195.26 73.02,193.29 | LED95.1 91.2,196.14 92.07,195.26 92.07,193.29 | LED93.1 129.3,196.14 130.17,195.26 130.17,193.29 | LED94.1 110.25,196.14 111.12,195.26 111.12,193.29 | LED37.1 17.62,85.56 19.05,84.14 36.51,84.14 | 36.51,84.14 55.56,84.14 | 55.56,84.14 74.61,84.14 | 93.66,84.14 112.71,84.14 | 112.71,84.14 131.76,84.14 | 131.76,84.14 150.81,84.14 | 150.81,84.14 161.92,84.14 | 161.92,84.14 174.07,84.14 LED45.1 | LED54.1 15,69.14 15.87,68.26 15.87,66.67 17.46,65.09 34.93,65.09 | 34.93,65.09 53.98,65.09 | 53.98,65.09 73.02,65.09 | 73.02,65.09 92.07,65.09 | 92.07,65.09 111.12,65.09 | 111.12,65.09 130.17,65.09 | 130.17,65.09 149.22,65.09 | 149.22,65.09 174.62,65.09 | 174.62,65.09 174.62,67.39 LED46.1 172.8,69.22 170.05,69.22 165.86,73.41 163.32,73.41 162.8,73.93 LED85.1 | LED51.1 72.15,69.14 73.02,68.26 73.02,65.09 | LED52.1 53.1,69.14 53.98,68.26 53.98,65.09 | LED50.1 91.2,69.14 92.07,68.26 92.07,65.09 | LED49.1 110.25,69.14 111.12,68.26 111.12,65.09 | LED53.1 34.05,69.14 34.93,68.26 34.93,65.09 | LED48.1 129.3,69.14 130.17,68.26 130.17,65.09
  Top 0.381: LED47.1 148.35,69.14 149.22,68.26 149.22,65.09 | LED42.1 112.88,84.3 112.71,84.14 | LED43.1 131.92,84.3 131.76,84.14 | LED44.1 150.97,84.3 150.81,84.14 | LED41.1 93.82,84.3 93.66,84.14 | LED40.1 74.77,84.3 74.61,84.14 | LED39.1 55.73,84.3 55.56,84.14 | LED38.1 36.68,84.3 36.51,84.14 | LED36.1 15,107.24 15.87,106.36 15.87,104.78 17.46,103.19 34.93,103.19 | 34.93,103.19 53.98,103.19 | 53.98,103.19 73.02,103.19 | 73.02,103.19 92.07,103.19 | 92.07,103.19 111.12,103.19 | 111.12,103.19 130.17,103.19 | 130.17,103.19 149.22,103.19 | 149.22,103.19 162.81,103.19 | 162.81,103.19 174.62,103.19 | 174.62,103.19 174.62,105.49 LED12.1 170.38,107.24 166.5,111.12 163.7,111.12 162.81,112.01 162.81,112.86 LED87.1 162.8,115.17 v162.81,115.19 | 162.81,122.24 174.62,122.24 176.38,123.99 LED11.1 175.13,125.78 175.13,126.75 177.55,129.16 177.55,131.44 174.5,134.49 v173.74,134.49 163.96,134.49 162.8,133.34 LED88.1 | 162.81,122.24 150.81,122.24 | 150.81,122.24 131.76,122.24 | 131.76,122.24 112.71,122.24 | 112.71,122.24 93.66,122.24 | 93.66,122.24 74.61,122.24 | 74.61,122.24 55.56,122.24 | 55.56,122.24 36.51,122.24 | 36.51,122.24 19.92,122.24 LED3.1 | LED4.1 36.68,122.4 36.51,122.24 | LED35.1 34.05,107.24 34.93,106.36 34.93,103.19 | LED34.1 53.1,107.24 53.98,106.36 53.98,103.19 | LED5.1 55.73,122.4 55.56,122.24 | LED6.1 74.77,122.4 74.61,122.24 | LED33.1 72.15,107.24 73.02,106.36 73.02,103.19 | LED32.1 91.2,107.24 92.07,106.36 92.07,103.19 | LED7.1 93.82,122.4 93.66,122.24 | LED8.1 112.88,122.4 112.71,122.24 | LED31.1 110.25,107.24 111.12,106.36 111.12,103.19 | LED30.1 129.3,107.24 130.17,106.36 130.17,103.19 | LED9.1 131.92,122.4 131.76,122.24
  Top 0.381: LED10.1 150.97,122.4 150.81,122.24 | LED29.1 148.35,107.24 149.22,106.36 149.22,103.19 | 162.05,7.94 174.62,7.94 176.38,9.69 LED81.1 177.37,10.24 178.18,11.05 178.18,18.8 179.32,19.94 179.32,22.35 178.18,23.5 178.18,35.81 180.47,38.1 180.47,48.89 177.93,51.44 177.8,51.44 | 162.05,7.94 150.81,7.94 | LED57.1 55.73,46.07 55.75,46.04 | 74.61,84.14 79.38,84.14 80.96,85.72 84.14,85.72 85.72,84.14 93.66,84.14 | LED83.1 162.8,39.23 v162.81,39.24 | v162.81,41.02 162.81,45.91 162.69,46.04 | LED90.1 175.88,161.05 | 175.88,161.05 175.13,161.8 175.13,167.75 LED21.1 | v162.81,117.35 162.81,122.24 | 174.62,141.29 174.62,137.03 v173.74,136.14 | 172.09,153.67 164.34,153.67 162.81,152.15 162.81,150.99 LED89.1 162.81,150.96 162.81,150.37 162.18,149.73 v159.89,149.73 | 175.88,161.05 175.88,157.59 v173.35,155.07 | v173.35,153.67 172.09,153.67 | v161.92,11.18 161.92,15.88 162.8,16.75 LED82.1 162.8,20.18 v162.81,20.19 | v162.05,9.4 162.05,7.94 | v162.81,22.22 162.81,26.86 162.69,26.99 | v161.8,87.63 161.92,87.76 161.92,92.2 162.8,93.08 LED86.1 162.8,96.38 v162.81,96.39 | v161.8,85.72 161.8,84.26 161.92,84.14 | v162.81,98.17 162.81,103.19 | U1.2 161.77,182.09 161.67,181.99 159.89,181.99 159,182.88 | 177.8,51.44 177.8,56.9 | 178.31,65.41 178.31,62.61 178.94,61.98 178.94,57.78 178.05,56.9 177.8,56.9 | 178.31,65.41 178.31,74.42 180.09,76.2 180.09,89.15 177.8,91.44 177.8,93.85 179.83,95.88 179.83,99.95 176.59,103.19 174.62,103.19 | LED84.1 162.8,57.52 163.7,58.42 174.24,58.42 175.77,56.9 177.8,56.9 | v155.45,195.71 152.78,195.71 152.4,195.33 149.22,195.33 | 159,182.88 157.35,182.88 | 157.35,182.88 155.57,182.88 154.81,183.64 v154.81,185.42
  Top 0.381: 135.64,193.29 v135.64,190.37 | v135.51,185.42 v135.51,180.72 | v135.51,178.56 135.51,178.44 133.35,176.28 133.35,171.96 v135,170.31 | v135,168.02 135,166.69 | ISP1.2 164.47,170.81 165.61,169.67 165.61,167.39 164.34,166.12 159.89,166.12 v159.77,166.24 | v153.92,166.24 152.02,166.24 | 152.02,166.24 148.91,166.24 148.46,166.69 | 161.16,177.04 157.99,177.04 157.48,177.55 157.48,179.07 v157.35,179.2 | v157.35,181.61 157.35,182.88 | v171.45,179.96 169.16,179.96 168.4,179.2 165.21,179.2 164.27,180.14 | 174.62,65.09 177.99,65.09 178.31,65.41 | v158.24,199.52 157.1,198.37 157.1,197.23 v156.97,197.23 | 152.02,166.24 152.02,160.78 v156.34,156.46 | v156.46,153.29 156.46,151.26 v157.99,149.73
  Bottom 0.381: v170.56,191.77 v170.56,194.82 | v164.08,199.77 v161.42,199.77 158.5,199.77 v158.24,199.52 | v166.5,196.47 v166.5,193.68 | v162.81,39.24 v162.81,41.02 | v162.81,115.19 v162.81,117.35 | v173.74,136.14 v173.74,134.49 | v173.35,155.07 v173.35,153.67 | v161.92,11.18 161.92,9.53 v162.05,9.4 | v162.81,20.19 v162.81,22.22 | v161.8,87.63 v161.8,85.72 | v162.81,96.39 v162.81,98.17 | v154.81,185.42 154.81,187.45 155.96,188.59 155.96,190.37 v155.83,190.5 155.83,195.33 v155.45,195.71 v156.97,197.23 | v135.64,190.37 135.64,185.55 v135.51,185.42 | v135.51,180.72 v135.51,178.56 | v135,170.31 v135,168.02 | v159.77,166.24 v153.92,166.24 | v157.35,179.2 v157.35,181.61 | v170.31,182.25 170.31,181.1 v171.45,179.96 | v156.34,156.46 156.34,153.42 v156.46,153.29 | v157.99,149.73 v159.89,149.73
COL1  (via drill 0.3)
  Top 0.254: v168.66,193.93 167.51,195.07 v163.19,195.07 | D49.A 5.61,14.07 4.45,15.24 4.45,32.89 | 4.45,32.89 4.45,52.32 | 4.45,52.32 4.45,71.25 | 4.45,71.25 4.45,80.01 5.46,81.03 5.46,84.33 4.45,85.34 4.45,90.3 | 4.45,90.3 4.45,109.09 | 4.45,109.09 4.45,128.14 | 4.45,128.14 4.45,147.57 | 4.45,147.57 4.45,159.13 5.59,160.27 5.59,163.7 4.57,164.72 4.57,172.59 | 4.57,172.59 4.57,196.57 D74.A 12.42,197.97 13.08,198.63 13.08,200.91 14.99,202.82 14.99,205.1 17.4,207.52 77.85,207.52 79.5,205.87 v90.8,205.87 | D1.A 4.8,172.82 4.57,172.59 | D5.A 4.59,147.43 4.45,147.57 | D8.A 4.68,128.38 4.45,128.14 | D12.A 4.68,109.33 4.45,109.09 | D37.A 4.47,71.22 4.45,71.25 | D15.A 4.47,90.28 4.45,90.3 | D40.A 4.59,52.17 4.45,52.32 | D44.A 4.68,33.12 4.45,32.89 | U1.22 167.12,191.5 v167.51,191.9 | v161.16,195.71 160.78,195.33 157.1,195.33 156.34,196.09 156.34,202.82 v155.7,203.45 | v153.92,207.52 152.15,207.52 151.51,206.88 99.06,206.88 v98.04,205.87 | v92.33,204.34 93.6,203.07 96.65,203.07 v98.04,204.47
  Bottom 0.254: v167.51,191.9 168.66,192.79 v168.66,193.93 | v163.19,195.07 161.8,195.07 v161.16,195.71 | v153.92,207.52 153.92,205.23 v155.7,203.45 | v90.8,205.87 v92.33,204.34 | v98.04,204.47 v98.04,205.87
COL2  (via drill 0.3)
  Top 0.254: U1.36 144.99,188.57 144.53,189.04 122.24,189.04 121.73,189.55 25.97,189.55 | D50.A 24.91,14.07 23.88,15.11 v23.88,20.19 | v23.88,21.84 v23.88,26.16 | v23.88,29.97 23.88,33.02 | 23.88,33.02 v23.88,39.24 | v23.88,40.64 v23.88,45.21 | v23.88,49.15 23.88,51.82 | 23.88,51.82 v23.88,58.29 | v23.88,60.07 v23.88,64.14 | v23.88,68.07 23.88,71.25 | 23.88,71.25 v23.88,77.34 | v23.88,78.87 v23.88,83.19 | v23.88,87.25 23.88,90.04 | 23.88,90.04 v23.88,96.27 | v23.88,97.92 v23.88,102.36 | v23.88,106.3 23.88,109.35 | 23.88,109.35 v23.88,115.44 | v23.88,117.22 v23.88,121.41 | v23.88,125.35 23.88,128.52 | 23.88,128.52 v23.88,134.49 | v23.88,136.14 v23.88,140.46 | v23.88,144.53 23.88,147.32 | 23.88,147.32 v23.88,153.42 | v23.88,155.32 v23.88,165.48 | v23.88,169.93 23.88,172.97 | 23.88,172.97 v23.88,178.94 | v23.88,180.97 23.88,187.45 25.97,189.55 | D75.A v25.4,195.33 | v25.4,192.41 25.4,190.12 25.97,189.55 | D45.A 23.98,33.12 23.88,33.02 | D41.A 24.23,52.17 23.88,51.82 | D38.A 23.9,71.22 23.88,71.25 | D16.A 24.11,90.28 23.88,90.04 | D2.A 24.02,172.82 23.88,172.97 | D6.A 23.98,147.43 23.88,147.32 | D9.A 24.02,128.38 23.88,128.52 | D13.A 23.9,109.33 23.88,109.35
  Bottom 0.254: v23.88,20.19 v23.88,21.84 | v23.88,26.16 v23.88,29.97 | v23.88,39.24 v23.88,40.64 | v23.88,45.21 v23.88,49.15 | v23.88,58.29 v23.88,60.07 | v23.88,64.14 v23.88,68.07 | v23.88,77.34 v23.88,78.87 | v23.88,83.19 v23.88,87.25 | v23.88,96.27 v23.88,97.92 | v23.88,102.36 v23.88,106.3 | v23.88,115.44 v23.88,117.22 | v23.88,121.41 v23.88,125.35 | v23.88,134.49 v23.88,136.14 | v23.88,140.46 v23.88,144.53 | v23.88,153.42 v23.88,155.32 | v23.88,165.48 v23.88,169.93 | v23.88,178.94 v23.88,180.97 | v25.4,195.33 v25.4,192.41
COL3  (via drill 0.3)
  Top 0.254: D53.A v44.45,16.38 | v44.45,21.72 v44.45,26.16 | v44.45,30.1 D46.A v44.45,35.43 | v44.45,40.89 v44.45,44.83 | v44.45,49.28 D42.A v44.45,54.48 | v44.45,60.07 v44.45,64.01 | v44.45,68.33 D39.A v44.45,73.53 | v44.45,79.12 v44.45,83.19 | v44.45,87.38 D51.A v44.45,92.46 | v44.45,98.3 v44.45,102.36 | v44.45,106.3 D14.A v44.45,111.51 | v44.45,117.09 v44.45,121.28 | v44.45,125.35 D10.A v44.45,130.56 | v44.45,136.14 v44.45,140.34 | v44.45,144.4 D7.A | 44.45,148.08 D7.A | D7.A v44.45,149.48 | v44.45,155.45 v44.45,165.1 | v44.45,170.05 D3.A v44.45,175.01 | v44.45,180.59 v44.45,188.59 v97.03,188.59 | v44.45,195.45 D76.A | U1.19 168.54,188.07 169.04,188.09 169.29,188.09 170.81,189.61 170.81,190.88 171.7,191.77 178.05,191.77 v178.31,192.02 | v180.21,193.93 180.21,194.94 182.12,196.85 182.12,204.34 175.39,211.07 154.56,211.07 151.13,207.65 v99.44,207.65 | v99.31,203.58 v99.31,195.07 | v99.31,192.41 v97.16,190.25
  Bottom 0.254: v44.45,16.38 v44.45,21.72 | v44.45,26.16 v44.45,30.1 | v44.45,35.43 v44.45,40.89 | v44.45,44.83 v44.45,49.28 | v44.45,54.48 v44.45,60.07 | v44.45,64.01 v44.45,68.33 | v44.45,73.53 v44.45,79.12 | v44.45,83.19 v44.45,87.38 | v44.45,92.46 v44.45,98.3 | v44.45,102.36 v44.45,106.3 | v44.45,111.51 v44.45,117.09 | v44.45,121.28 v44.45,125.35 | v44.45,130.56 v44.45,136.14 | v44.45,140.34 v44.45,144.4 | v44.45,149.48 v44.45,155.45 | v44.45,165.1 v44.45,170.05 | v44.45,175.01 v44.45,180.59 | v44.45,188.59 v44.45,195.45 | v178.31,192.02 v180.21,193.93 | v99.44,207.65 99.44,203.71 v99.31,203.58 | v99.31,195.07 v99.31,192.41 | v97.16,190.25 97.16,188.72 v97.03,188.59
COL4  (via drill 0.3)
  Top 0.254: D54.A v63.5,16.38 | v63.5,21.97 v63.5,26.16 | v63.5,30.48 D47.A v63.5,35.43 | v63.5,40.89 v63.5,45.08 | v63.5,49.28 D43.A v63.5,54.36 | v63.5,59.94 v63.5,64.14 | v63.5,68.33 D48.A v63.5,73.28 | v63.5,79.12 v63.5,83.06 | v63.5,87.12 D52.A v63.5,92.46 | v63.5,98.04 v63.5,102.23 | v63.5,106.3 D19.A v63.5,111.51 | v63.5,117.09 v63.5,121.16 | v63.5,125.48 D11.A v63.5,130.56 | v63.5,136.27 v63.5,140.34 | v63.5,144.4 D20.A v63.5,149.48 | v63.5,155.96 v63.5,165.48 | v63.5,169.93 D4.A v63.5,175.13 | v63.5,180.72 63.5,187.71 v63.63,187.83 | v63.5,190.5 v63.5,192.28 | v63.5,195.2 D78.A 63.22,198.5 62.74,198.5 61.72,199.52 61.72,203.07 62.74,204.09 v63.63,204.09 | U1.18 169.54,187.57 171.45,189.48 171.45,190.5 172.09,191.13 179.45,191.13 v179.96,191.64 | v181.61,193.29 182.88,194.56 182.88,204.47 175.64,211.71 154.18,211.71 150.88,208.41 v101.73,208.41 | v89.28,206.63 79.63,206.63 77.72,208.53 63.88,208.53 v63.63,208.79 | v90.04,204.34 91.57,202.82 92.96,202.82 93.22,202.56 97.79,202.56 98.68,203.45 98.68,203.96 99.19,204.47 v101.6,204.47
  Bottom 0.254: v63.5,16.38 v63.5,21.97 | v63.5,26.16 v63.5,30.48 | v63.5,35.43 v63.5,40.89 | v63.5,45.08 v63.5,49.28 | v63.5,54.36 v63.5,59.94 | v63.5,64.14 v63.5,68.33 | v63.5,73.28 v63.5,79.12 | v63.5,83.06 v63.5,87.12 | v63.5,92.46 v63.5,98.04 | v63.5,102.23 v63.5,106.3 | v63.5,111.51 v63.5,117.09 | v63.5,121.16 v63.5,125.48 | v63.5,130.56 v63.5,136.27 | v63.5,140.34 v63.5,144.4 | v63.5,149.48 v63.5,155.96 | v63.5,165.48 v63.5,169.93 | v63.5,175.13 v63.5,180.72 | v63.63,187.83 63.63,190.37 v63.5,190.5 | v63.5,192.28 v63.5,195.2 | v179.96,191.64 v181.61,193.29 | v63.63,208.79 v63.63,204.09 | v89.28,206.63 89.28,205.1 v90.04,204.34 | v101.6,204.47 101.6,208.28 v101.73,208.41
COL5  (via drill 0.3)
  Top 0.254: U1.41 153.43,186.07 153.42,186.06 82.61,186.06 | D67.A 82.55,14.35 80.9,16 v80.9,20.19 | v80.77,22.1 80.77,26.03 v80.9,26.16 | v80.9,30.23 80.9,33.02 | 80.9,33.02 v80.9,38.99 | v80.9,41.02 v80.9,45.21 | v80.9,49.02 80.9,52.07 | 80.9,52.07 v80.9,58.29 | v80.9,60.07 v80.9,64.14 | v80.9,68.33 80.9,70.87 | 80.9,70.87 v80.9,77.34 | v80.9,79.25 80.39,79.25 79.12,80.52 v79.12,83.19 | v79.12,87.5 79.12,88.65 80.77,90.3 | 80.77,90.3 v80.77,96.39 | v80.77,98.3 v80.77,102.36 | v80.77,106.3 80.77,109.22 | 80.77,109.22 v80.77,115.32 | v80.77,117.09 v80.77,121.41 | v80.77,125.35 80.77,128.27 | 80.77,128.27 v80.77,134.37 | v80.77,136.02 v80.77,140.46 | v80.77,144.27 80.77,147.32 | 80.77,147.32 80.77,153.29 v80.64,153.42 | v80.64,155.19 80.64,157.61 78.87,159.38 78.87,164.21 v80.26,165.61 | v80.26,169.93 80.26,170.94 | 80.26,170.94 81.79,172.47 82.19,172.47 D17.A | D23.A 80.88,147.43 80.77,147.32 | D26.A 80.88,128.38 80.77,128.27 | 80.26,170.94 v80.26,178.82 | v80.26,180.72 80.26,183.71 82.61,186.06 | 82.61,186.06 82.61,187.01 v82.55,187.2 | v82.55,190.37 v82.55,192.41 | v82.55,195.33 D79.A | D62.A 81,33.12 80.9,33.02 | D58.A 81,52.17 80.9,52.07 | D55.A 81.26,71.22 80.9,70.87 | D35.A 80.79,90.28 80.77,90.3 | D30.A 80.88,109.33 80.77,109.22
  Bottom 0.254: v80.9,20.19 80.9,21.97 v80.77,22.1 | v80.9,26.16 v80.9,30.23 | v80.9,38.99 v80.9,41.02 | v80.9,45.21 v80.9,49.02 | v80.9,58.29 v80.9,60.07 | v80.9,64.14 v80.9,68.33 | v80.9,77.34 v80.9,79.25 | v79.12,83.19 v79.12,87.5 | v80.77,96.39 v80.77,98.3 | v80.77,102.36 v80.77,106.3 | v80.77,115.32 v80.77,117.09 | v80.77,121.41 v80.77,125.35 | v80.77,134.37 v80.77,136.02 | v80.77,140.46 v80.77,144.27 | v80.64,153.42 v80.64,155.19 | v80.26,165.61 v80.26,169.93 | v80.26,178.82 v80.26,180.72 | v82.55,187.2 v82.55,190.37 | v82.55,192.41 v82.55,195.33
COL6  (via drill 0.3)
  Top 0.254: U1.40 102.1,186.57 101.73,186.94 v101.73,187.45 v101.73,188.98 | v101.73,195.07 D81.A | v101.6,175.01 D18.A v101.6,169.8 | v101.6,180.72 v101.6,185.29 | v101.6,149.73 D24.A v101.6,144.4 | v101.6,155.45 v101.6,165.86 | D68.A v101.6,16.13 | v101.6,21.84 v101.6,26.29 | v101.6,30.1 D63.A v101.6,35.05 | v101.6,40.77 v101.6,44.96 | v101.6,49.15 D59.A v101.6,54.48 | v101.6,59.82 v101.6,64.14 | v101.6,68.45 D56.A v101.6,73.53 | v101.6,111.51 D31.A v101.6,106.55 | v101.6,116.97 v101.6,121.28 | v101.6,125.22 D27.A v101.6,130.68 | v101.6,136.02 v101.6,140.34 | v101.6,78.87 v101.6,83.31 | v101.6,87.12 D36.A v101.6,92.33 | v101.6,98.3 v101.6,102.23
  Bottom 0.254: v101.73,188.98 v101.73,195.07 | v101.6,175.01 v101.6,180.72 | v101.6,185.29 101.6,187.32 v101.73,187.45 | v101.6,149.73 v101.6,155.45 | v101.6,165.86 v101.6,169.8 | v101.6,16.13 v101.6,21.84 | v101.6,26.29 v101.6,30.1 | v101.6,35.05 v101.6,40.77 | v101.6,44.96 v101.6,49.15 | v101.6,54.48 v101.6,59.82 | v101.6,64.14 v101.6,68.45 | v101.6,111.51 v101.6,116.97 | v101.6,121.28 v101.6,125.22 | v101.6,130.68 v101.6,136.02 | v101.6,140.34 v101.6,144.4 | v101.6,73.53 v101.6,78.87 | v101.6,83.31 v101.6,87.12 | v101.6,92.33 v101.6,98.3 | v101.6,102.23 v101.6,106.55
COL7  (via drill 0.3)
  Top 0.254: U1.39 121.16,187.07 v120.78,187.45 v120.78,188.85 | v120.65,149.73 D25.A v120.65,144.65 | v120.65,155.32 v120.65,165.74 | v120.65,170.05 D21.A v120.65,174.88 | v120.65,180.59 v120.65,185.29 | v120.78,195.45 120.78,198.1 D82.A | D71.A v120.65,16.38 | v120.65,21.84 v120.65,26.16 | v120.65,30.1 D64.A v120.65,35.31 | v120.65,40.89 v120.65,45.08 | v120.65,49.53 D60.A v120.65,54.36 | v120.65,59.94 v120.65,64.26 | v120.65,68.2 D57.A v120.65,73.41 | v120.65,78.99 v120.65,83.31 | v120.65,87.12 D69.A v120.65,92.33 | v120.65,98.17 v120.65,102.23 | v120.65,106.3 D32.A v120.65,111.51 | v120.65,117.22 v120.65,121.16 | v120.65,125.48 D28.A v120.65,130.43 | v120.65,136.14 v120.65,140.21
  Bottom 0.254: v120.65,149.73 v120.65,155.32 | v120.65,165.74 v120.65,170.05 | v120.65,174.88 v120.65,180.59 | v120.65,185.29 120.65,187.32 v120.78,187.45 | v120.78,188.85 v120.78,195.45 | v120.65,16.38 v120.65,21.84 | v120.65,26.16 v120.65,30.1 | v120.65,35.31 v120.65,40.89 | v120.65,45.08 v120.65,49.53 | v120.65,54.36 v120.65,59.94 | v120.65,64.26 v120.65,68.2 | v120.65,73.41 v120.65,78.99 | v120.65,83.31 v120.65,87.12 | v120.65,92.33 v120.65,98.17 | v120.65,102.23 v120.65,106.3 | v120.65,111.51 v120.65,117.22 | v120.65,121.16 v120.65,125.48 | v120.65,130.43 v120.65,136.14 | v120.65,140.21 v120.65,144.65
COL8  (via drill 0.3)
  Top 0.254: U1.38 140.09,187.57 139.7,187.96 v139.57,187.96 | D72.A v139.7,16 | v139.7,22.1 v139.7,26.16 | v139.7,30.35 D65.A v139.7,35.18 | v139.7,40.77 v139.7,44.96 | v139.7,49.28 D61.A v139.7,54.23 | v139.7,59.94 v139.7,64.14 | v139.7,68.2 D66.A v139.7,73.41 | v139.7,79.25 v139.7,83.31 | v139.7,87.25 D70.A v139.7,92.33 | v139.7,98.04 v139.7,102.23 | v139.7,106.43 D33.A v139.7,111.51 | v139.7,117.22 v139.7,121.41 | v139.7,125.6 D29.A v139.7,130.68 | v139.7,136.14 v139.7,140.34 | v139.7,144.53 D34.A v139.7,149.61 | v139.7,155.57 v139.7,165.74 | v139.7,170.05 D22.A v139.7,175.01 | v139.7,180.47 v139.7,185.17 | D83.A v139.7,195.2 | v139.7,192.41 v139.7,190.37
  Bottom 0.254: v139.7,16 v139.7,22.1 | v139.7,26.16 v139.7,30.35 | v139.7,35.18 v139.7,40.77 | v139.7,44.96 v139.7,49.28 | v139.7,54.23 v139.7,59.94 | v139.7,64.14 v139.7,68.2 | v139.7,73.41 v139.7,79.25 | v139.7,83.31 v139.7,87.25 | v139.7,92.33 v139.7,98.04 | v139.7,102.23 v139.7,106.43 | v139.7,111.51 v139.7,117.22 | v139.7,121.41 v139.7,125.6 | v139.7,130.68 v139.7,136.14 | v139.7,140.34 v139.7,144.53 | v139.7,149.61 v139.7,155.57 | v139.7,165.74 v139.7,170.05 | v139.7,175.01 v139.7,180.47 | v139.7,185.17 139.7,187.96 | 139.7,187.96 v139.7,190.37 | v139.7,195.2 v139.7,192.41 | v139.57,187.96 139.7,187.96
COL9  (via drill 0.3)
  Top 0.254: D85.A 164.59,198.25 v163.07,198.25 | 161.16,198.25 v161.67,198.25 v160.15,198.25 | U1.37 154.69,188.09 144.02,188.09 v143.89,188.21 | v161.8,173.61 162.58,172.82 D73.A 165.12,172.85 165.61,172.85 165.61,172.59 166.24,171.96 166.24,166.24 v165.1,165.1 | D103.A v165.1,16 | v165.1,21.97 v165.1,26.16 | v165.1,29.97 D98.A v165.1,35.18 | v165.1,40.89 v165.1,45.08 | v165.1,49.28 D94.A v165.1,54.23 | v165.1,59.94 v165.1,64.01 | v165.1,68.2 D91.A v165.1,72.64 | v165.1,78.99 v165.1,83.19 | v165.1,87.38 D89.A v165.1,92.33 | v165.1,97.92 v165.1,102.36 | v165.1,106.3 D84.A v165.1,110.36 | v165.1,116.97 v165.1,121.28 | v165.1,125.48 D80.A v165.1,130.56 | v165.1,136.02 v165.1,140.34 | v165.1,144.4 D77.A v165.1,149.61 | v165.1,155.45 v165.1,158.62 | v154.31,170.81 154.31,170.94 151.76,173.48 151.76,176.91 144.02,184.66 v144.02,185.42 | v143.89,190.5 v143.89,192.53 | v143.89,195.2 145.8,197.1 150.75,197.1 v151,197.36 | v153.16,197.36 154.81,197.36 v155.7,198.25
  Bottom 0.254: v163.07,198.25 v161.67,198.25 | v161.8,173.61 157.1,173.61 v154.31,170.81 | v165.1,16 v165.1,21.97 | v165.1,26.16 v165.1,29.97 | v165.1,35.18 v165.1,40.89 | v165.1,45.08 v165.1,49.28 | v165.1,54.23 v165.1,59.94 | v165.1,64.01 v165.1,68.2 | v165.1,72.64 v165.1,78.99 | v165.1,83.19 v165.1,87.38 | v165.1,92.33 v165.1,97.92 | v165.1,102.36 v165.1,106.3 | v165.1,110.36 v165.1,116.97 | v165.1,121.28 v165.1,125.48 | v165.1,130.56 v165.1,136.02 | v165.1,140.34 v165.1,144.4 | v165.1,149.61 v165.1,155.45 | v165.1,158.62 v165.1,165.1 | v160.15,198.25 v155.7,198.25 | v144.02,185.42 143.89,185.55 v143.89,188.21 v143.89,190.5 | v143.89,192.53 v143.89,195.2 | v151,197.36 v153.16,197.36
DM  (via drill 0.3)
  Top 0.254: J1.2 162.71,202.08 159.38,198.75 v159.38,196.09 | v159.38,191.52 155.83,191.52 v153.54,189.23 | v153.54,185.42 153.54,183.77 156.46,180.85 158.81,180.85 R7.2
  Bottom 0.254: v159.38,196.09 v159.38,191.52 | v153.54,189.23 v153.54,185.42
DP  (via drill 0.3)
  Top 0.254: J1.3 161.92,202.18 158.11,198.37 v158.11,196.09 | v158.11,192.15 155.19,192.15 v152.27,189.23 | v152.27,185.42 152.27,184.15 156.34,180.09 158.69,180.09 R8.2
  Bottom 0.254: v158.11,196.09 v158.11,192.15 | v152.27,189.23 v152.27,185.42
GND  (via drill 0.3)
  Top 0.254: U$60.P$4 174.96,187.92 v175.01,187.96 | C15.2 174.69,189.8 v174.75,189.87 | U$60.P$2 172.31,185.01 v172.34,184.66 | C2.1 arc90 171.07,183.51 v171.07,183.01 | C1.1 169.67,189.99 v169.93,189.74 | 164.21,186.44 164.21,186.63 | 164.21,186.63 U1.TAB | U1.15 164.77,186.07 U1.TAB | U1.5 163.27,186.57 U1.TAB | U1.43 161.83,185.07 v162.31,185.55 164.08,185.67 164.21,185.8 | U1.35 161.77,189.07 162.12,188.72 v162.18,188.72 162.94,187.71 v165.23,188.59 166.27,189.63 U1.23 | 164.21,186.63 164.21,186.69 v165.23,185.55 | C14.2 v158.24,178.56 | C16.2 177.16,186.31 v177.04,186.44 | v160.02,202.18 160.35,202.51 J1.5 160.35,205.41 v160.15,205.61 | LED91.3 175.56,194.39 v175.51,194.44 | C3.1 v156.97,190.12 | C13.2 v155.96,185.29 | C4.1 v155.96,183.77 | LED21.3 172.16,170.74 v172.09,170.81 | LED46.3 177.34,67.39 v177.42,67.31 | LED45.3 173.69,88.19 v173.74,88.14 | LED12.3 177.37,105.49 v177.42,105.54 | LED11.3 173.69,126.29 v173.86,126.11 | LED22.3 177.37,143.59 v177.42,143.64 | LED63.3 171.88,50.09 v171.7,49.91 | LED64.3 177.24,29.29 v177.29,29.34 | LED81.3 172.01,11.99 v171.96,11.94 | LED80.3 146.48,11.99 v146.43,11.94 | LED65.3 150.97,28.48 v151,28.45 | LED79.3 127.43,11.99 v127.38,11.94 | LED66.3 131.92,28.35 v131.95,28.32 | LED67.3 112.88,28.22 v112.9,28.19 | LED78.3 108.38,11.99 v108.33,11.94 | LED77.3 89.33,11.99 v89.28,11.94 | LED68.3 93.82,28.35 v93.85,28.32 | LED69.3 74.77,28.35 v74.8,28.32 | LED76.3 70.28,11.99 v70.23,11.94 | LED75.3 51.23,11.99 v51.18,11.94 | LED70.3 55.73,28.35 v55.75,28.32 | LED71.3 36.68,28.55 v36.58,28.45 | LED74.3 32.18,11.99 v32.13,11.94 | LED73.3 13.13,11.99 v13.08,11.94 | LED72.3 17.62,28.6 v17.91,28.32
  Top 0.254: LED55.3 14.94,50.09 v14.99,50.04 | LED56.3 33.99,50.09 v34.04,50.04 | LED57.3 53.16,50.09 v53.21,50.04 | LED52.3 55.73,66.45 v55.75,66.42 | LED53.3 36.68,66.45 v36.7,66.42 | LED54.3 17.62,66.45 v17.65,66.42 | LED51.3 74.77,66.45 v74.8,66.42 | LED50.3 93.82,66.58 v93.85,66.55 | LED58.3 72.34,50.09 v72.39,50.04 | LED59.3 91.36,50.09 v91.44,50.17 | LED60.3 110.41,50.09 v110.49,50.17 | LED49.3 112.88,66.65 v112.78,66.55 | LED48.3 131.92,66.45 v131.95,66.42 | LED61.3 129.36,50.09 v129.41,50.04 | LED62.3 148.39,50.09 v148.46,50.17 | LED47.3 150.97,66.58 v151,66.55 | LED44.3 148.41,88.19 v148.46,88.14 | LED43.3 129.21,88.19 v129.29,88.27 | LED29.3 150.16,105.49 v150.11,105.54 | LED30.3 131.92,104.55 v131.95,104.52 | LED31.3 112.88,104.68 v112.9,104.65 | LED32.3 93.82,104.42 v93.85,104.39 | LED41.3 91.23,88.19 v91.31,88.27 | LED42.3 110.16,88.19 v110.36,88.39 | LED40.3 72.21,88.19 v72.39,88.01 | LED33.3 74.77,104.55 v74.8,104.52 | LED37.3 14.91,88.19 v14.99,88.27 | LED36.3 17.62,104.68 v17.65,104.65 | LED35.3 36.68,104.68 v36.7,104.65 | LED38.3 33.96,88.19 v34.04,88.27 | LED39.3 53.13,88.19 v53.21,88.27 | LED34.3 55.73,104.55 v55.75,104.52 | LED4.3 34.09,126.29 v34.16,126.37 | LED5.3 53.13,126.29 v53.21,126.37 | LED3.3 15.06,126.29 v15.11,126.24 | LED2.3 17.62,142.78 v17.78,142.62 | LED1.3 36.68,142.65 v36.83,142.49 | LED28.3 55.73,142.65 v55.88,142.49 | LED27.3 74.77,142.65 v74.8,142.62 | LED6.3 72.21,126.29 v72.26,126.24 | LED7.3 91.14,126.29 v91.19,126.24 | LED26.3 93.82,142.65 v93.85,142.62 | LED25.3 112.88,142.65 v112.9,142.62 | LED8.3 110.29,126.29 v110.36,126.37 | LED9.3 129.21,126.29 v129.29,126.37 | LED24.3 131.92,142.78 v131.95,142.75
  Top 0.254: LED10.3 148.51,126.29 v148.59,126.37 | LED23.3 150.97,142.9 v151,142.88 | LED13.3 15.06,170.74 v15.11,170.69 | LED99.3 17.32,194.39 v16.64,195.07 | LED98.3 36.68,194.47 v36.07,195.07 | LED97.3 55.73,194.47 v55.12,195.07 | LED96.3 74.77,194.47 v74.17,195.07 | LED95.3 93.65,194.39 v93.09,194.94 | LED94.3 112.82,194.39 v112.27,194.94 | LED93.3 131.88,194.39 v131.19,195.07 | LED92.3 151,194.44 v150.24,194.44 | LED20.3 148.29,170.74 v148.34,170.69 | LED19.3 129.46,170.74 v129.54,170.81 | LED18.3 110.29,170.74 v110.36,170.81 | LED17.3 91.26,170.74 v91.31,170.69 | LED16.3 72.21,170.74 v72.26,170.69 | LED14.3 33.99,170.74 v34.04,170.69 | LED15.3 52.91,170.74 v52.96,170.69 | LED84.3 160.3,52.22 v160.27,52.2 | LED83.3 160.17,33.17 v160.02,33.02 | LED82.3 160.17,14.12 v160.15,14.1 | LED85.3 160.43,71.28 v160.27,71.12 | LED86.3 160.17,90.33 v160.15,90.3 | LED87.3 160.17,109.38 v160.15,109.35 | LED88.3 160.17,128.43 v160.15,128.4 | LED89.3 160.17,147.47 v160.15,147.45 | LED90.3 v171.84,162.8 v171.83,162.81
  Bottom 0.254: v175.01,187.96 175.26,187.96 | v174.75,189.87 175.13,189.87 | v172.34,184.66 171.2,184.78 | v169.93,189.74 170.81,189.74 | 164.85,187.71 164.85,187.45 | v162.18,188.72 162.81,185.8 v162.31,185.55 | v158.24,178.56 158.62,178.44 | v177.04,186.44 177.04,186.56 176.91,186.69 | v160.02,202.18 160.02,201.8 | v160.15,205.61 159.77,205.61 | v175.51,194.44 175.39,194.44 | v156.97,190.12 156.97,189.36 | v155.96,185.29 155.7,185.29 | v155.96,183.77 155.45,183.77 | v172.09,170.81 171.83,170.81 | v177.42,67.31 177.67,67.31 | v173.74,88.14 173.99,88.14 | v177.42,105.54 177.8,105.54 | v173.86,126.11 174.12,126.11 174.24,126.24 | v177.42,143.64 177.67,143.64 | v171.7,49.91 171.45,49.91 171.32,50.04 | v177.29,29.34 177.55,29.34 | v171.96,11.94 171.58,11.94 | v146.43,11.94 145.67,11.94 | v151,28.45 151,28.19 | v127.38,11.94 127.13,11.94 | v131.95,28.32 131.95,28.07 | v112.9,28.19 113.16,28.19 | v108.33,11.94 108.08,11.94 107.95,12.06 | v89.28,11.94 89.15,12.06 | v93.85,28.32 93.98,28.32 | v74.8,28.32 74.93,28.32 | v70.23,11.94 70.1,11.94 | v51.18,11.94 51.05,11.94 50.93,12.06 | v55.75,28.32 56.01,28.32 | v36.58,28.45 36.7,28.32 | v32.13,11.94 31.75,11.94 | v13.08,11.94 13.08,12.06 | v17.91,28.32 18.16,28.32 | v14.99,50.04 15.11,50.04 15.24,50.17 | v34.04,50.04 34.29,50.04 | v53.21,50.04 53.34,50.04 53.47,50.17 | v55.75,66.42 55.75,66.29 | v36.7,66.42 36.83,66.29 | v17.65,66.42 17.78,66.55 | v74.8,66.42 75.06,66.42 | v93.85,66.55 94.11,66.55 | v72.39,50.04 72.39,49.91 | v91.44,50.17 91.44,49.78 | v110.49,50.17 110.49,49.91 | v112.78,66.55 112.78,66.42 | v131.95,66.42 132.21,66.42 | v129.41,50.04 129.41,50.42 | v148.46,50.17 148.59,50.17 | v151,66.55 151.13,66.55 151.26,66.42
  Bottom 0.254: v148.46,88.14 148.72,88.14 | v129.29,88.27 129.54,88.27 129.67,88.14 | v150.11,105.54 150.11,105.41 | v131.95,104.52 132.08,104.65 | v112.9,104.65 113.16,104.65 | v93.85,104.39 94.11,104.39 94.23,104.52 | v91.31,88.27 91.57,88.27 | v110.36,88.39 110.74,88.39 110.87,88.27 | v72.39,88.01 72.52,88.01 72.64,88.14 | v74.8,104.52 75.06,104.52 | v14.99,88.27 15.11,88.27 15.24,88.14 | v17.65,104.65 17.78,104.52 | v36.7,104.65 36.96,104.65 | v34.04,88.27 34.16,88.27 | v53.21,88.27 53.47,88.27 | v55.75,104.52 55.88,104.52 56.01,104.65 | v34.16,126.37 34.29,126.24 | v53.21,126.37 53.34,126.37 | v15.11,126.24 15.24,126.24 15.37,126.37 | v17.78,142.62 18.03,142.62 | v36.83,142.49 37.08,142.49 | v55.88,142.49 56.01,142.49 | v74.8,142.62 75.06,142.62 | v72.26,126.24 72.39,126.37 | v91.19,126.24 91.31,126.24 91.44,126.37 | v93.85,142.62 93.98,142.62 | v112.9,142.62 113.16,142.62 | v110.36,126.37 110.49,126.37 | v129.29,126.37 129.41,126.37 | v131.95,142.75 132.08,142.62 | v148.59,126.37 148.72,126.37 | v151,142.88 151,142.62 | v15.11,170.69 15.37,170.69 | v16.64,195.07 16.38,195.33 | v36.07,195.07 36.07,195.2 35.94,195.33 | v55.12,195.07 55.12,195.33 | v74.17,195.07 74.17,195.2 74.04,195.33 | v93.09,194.94 93.09,195.07 | v112.27,194.94 112.14,195.07 | v131.19,195.07 131.19,194.94 | v148.34,170.69 148.46,170.69 148.59,170.81 | v129.54,170.81 129.67,170.69 | v110.36,170.81 110.49,170.81 | v91.31,170.69 91.57,170.69 | v72.26,170.69 72.52,170.69 | v34.04,170.69 34.16,170.81 | v52.96,170.69 53.21,170.94 | v160.27,52.2 160.27,52.07 160.15,51.94 | v160.02,33.02 159.89,33.02 159.77,33.15 | v160.15,14.1 160.15,14.22 160.02,14.35 | v160.27,71.12 160.02,71.12 159.89,71.25
  Bottom 0.254: v160.15,90.3 160.02,90.3 | v160.15,109.35 160.15,109.09 | v160.15,128.4 160.15,128.27 160.02,128.14 | v160.15,147.45 160.15,147.32 | v171.83,162.81 171.7,162.81 171.45,162.56
  pour Bottom: -6.35,215.9 192.09,215.9 190.5,0 arc-90 187.32,-3.18 -6.35,-3.18
LED  (via drill 0.3)